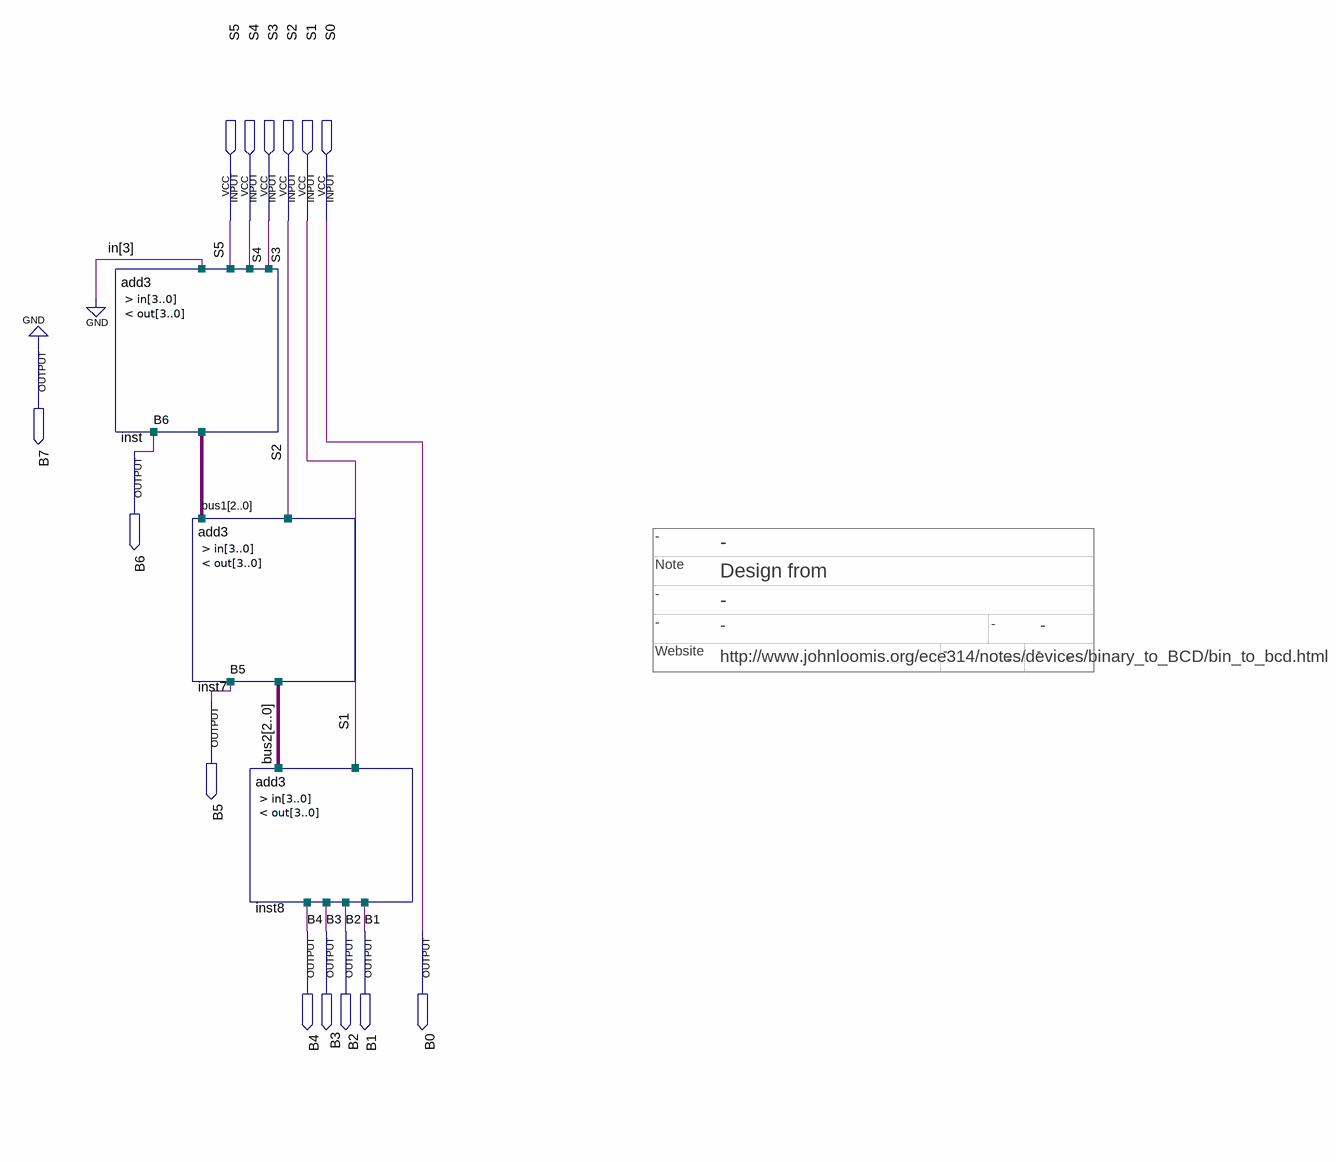
[diagram p0: schematic sheet]
// Quartus schematic 8bit_bcd_converter.bdf as structural Verilog: 3 symbols, 14 pins
// Title block: Note: Design from; Website: http://www.johnloomis.org/ece314/notes/devices/binary_to_BCD/bin_to_bcd.html; -: -; -: -; -: -; -: -; -: -; -: -
module \8bit_bcd_converter  (
  input  S5,
  input  S4,
  input  S3,
  input  S2,
  input  S1,
  input  S0,
  output B7,
  output B6,
  output B5,
  output B4,
  output B3,
  output B2,
  output B1,
  output B0
);

  add3 inst ();  // open: in, out
  add3 inst7 ();  // open: in, out
  add3 inst8 ();  // open: in, out

  assign B0 = S0;
  assign B7 = 1'b0;
endmodule
